# EAGLE design uart_opto_isolation (EAGLE 6.2)
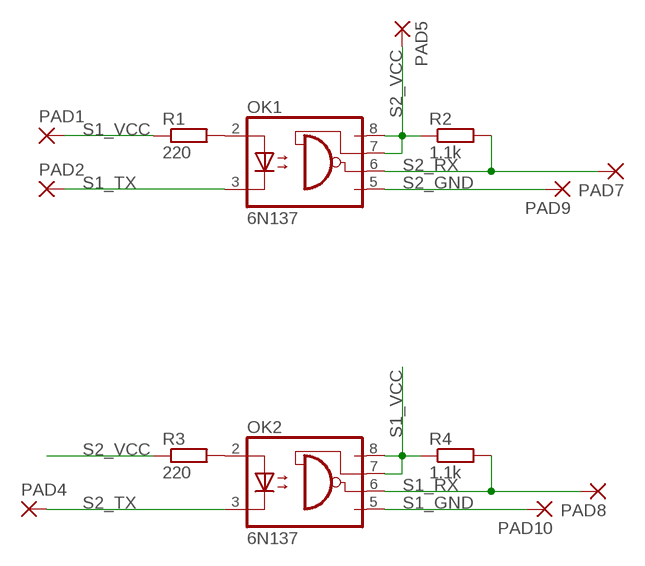
[diagram p0: schematic, sheet 1]

## Parts
OK1  6N137  [DIL08]
OK2  6N137  [DIL08]
PAD1  1,6/0,9  [1,6/0,9]
PAD2  1,6/0,9  [1,6/0,9]
PAD4  1,6/0,9  [1,6/0,9]
PAD5  1,6/0,9  [1,6/0,9]
PAD7  1,6/0,9  [1,6/0,9]
PAD8  1,6/0,9  [1,6/0,9]
PAD9  1,6/0,9  [1,6/0,9]
PAD10  1,6/0,9  [1,6/0,9]
R1  220  R-EU_R0805  [R0805]
R2  1.1k  R-EU_R0805  [R0805]
R3  220  R-EU_R0805  [R0805]
R4  1.1k  R-EU_R0805  [R0805]

## Nets
N$1: OK1.2(A) R1.2
N$2: OK2.2(A) R3.2
S1_GND: OK2.5(GND) PAD10.1(P)
S1_RX: OK2.6(VO) PAD8.1(P) R4.2
S1_TX: OK1.3(C) PAD2.1(P)
S1_VCC: OK2.7(VE) OK2.8(VCC) PAD1.1(P) R1.1 R4.1
S2_GND: OK1.5(GND) PAD9.1(P)
S2_RX: OK1.6(VO) PAD7.1(P) R2.2
S2_TX: OK2.3(C) PAD4.1(P)
S2_VCC: OK1.7(VE) OK1.8(VCC) PAD5.1(P) R2.1 R3.1

## Library data of the parts
OK1 OK2 = optocoupler:6N137: MOTOROLA OPTO COUPLER; MPN: 6N137; OC_FARNELL: 1328376; OC_NEWARK: 52M1895
PAD1 PAD2 PAD4 PAD5 PAD7-PAD10 = wirepad:1,6/0,9: THROUGH-HOLE PAD
R1-R4 = rcl:R-EU_: RESISTOR, European symbol

## Board
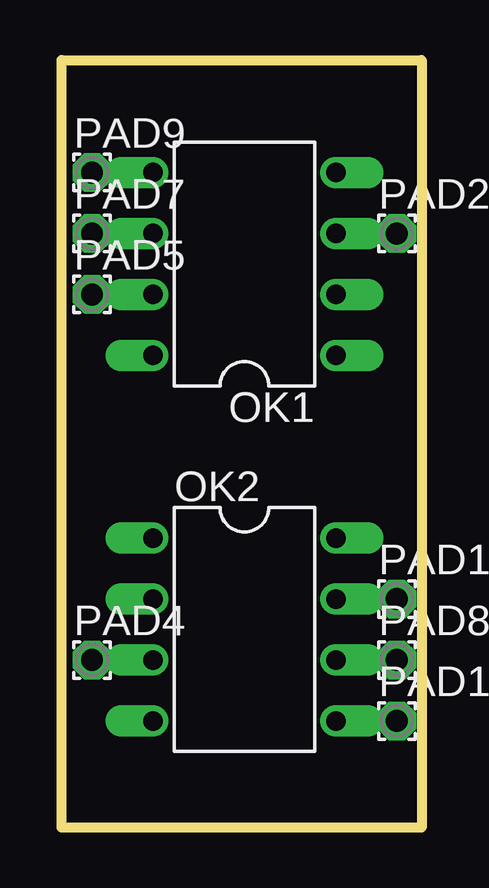
[diagram p1: board, top side]
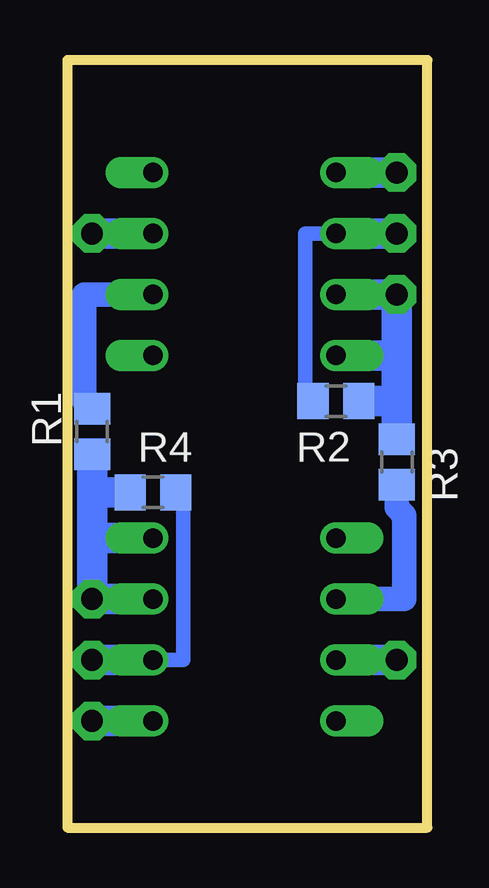
[diagram p2: board, bottom side, seen from below]

Size 15 x 32 mm. Coordinates in mm from the lower left corner, seen from the top.
Outline: 0,32 15,32 15,0 0,0 0,32
Copper layers (1*16): Top 0.035mm / dielectric 1.5mm / Bottom 0.035mm
Design rules: minimum track width 10mil, minimum drill 24mil, track to track 8mil, track to pad 8mil, pad to pad 8mil, via to via 8mil, smd to smd 8mil, copper to edge 40mil, drill to drill 8mil, minimum pad ring 10mil, minimum via ring 8mil, stop-mask expansion 4mil, vias tented up to drill 0mil, thermal gap 10mil

### Footprints (pad centres in the part's own frame; a part is rotated, then mirrored left to right if it is on the bottom)
DIL08 = drill 0.813 offset: 1 -3.81,-3.81; 2 -1.27,-3.81; 3 1.27,-3.81; 4 3.81,-3.81; 5 3.81,3.81; 6 1.27,3.81; 7 -1.27,3.81; 8 -3.81,3.81
1,6/0,9 = drill 0.914 pad 1.6 octagon: 1 0,0
R0805 = smd 1.3 x 1.5: 1 -0.95,0; 2 0.95,0

### Placement (x,y rotation side)
OK1  7.62,23.5 90 top
OK2  7.62,8.26 270 top
PAD1  13.97,9.53 0 top
PAD2  13.97,24.77 0 top
PAD4  1.27,6.99 0 top
PAD5  1.27,22.23 0 top
PAD7  1.27,24.77 0 top
PAD8  13.97,6.99 0 top
PAD9  1.27,27.3 0 top
PAD10  13.97,4.45 0 top
R1  13.97,16.51 90 bottom
R2  3.81,17.78 180 bottom
R3  1.27,15.24 270 bottom
R4  11.43,13.97 0 bottom

### Tracks (layer width: path | path; a pad name or v marks a point on that pad's centre or on a via)
N$1
  Bottom 1.016: OK1.2 14.29,22.23 14.29,17.78 R1.2
N$2
  Bottom 1.016: OK2.2 0.95,9.53 0.95,13.02 1.27,13.34 R3.2
S1_GND
  Bottom 1.27: OK2.5 PAD10.1
S1_RX
  Bottom 0.61: OK2.6 10.16,6.99 10.16,13.34 R4.2
  Bottom 1.27: OK2.6 PAD8.1
S1_TX
  Bottom 1.27: OK1.3 PAD2.1
S1_VCC
  Bottom 1.27: OK2.8 13.97,12.06 | 13.97,12.06 13.97,13.97 | 13.97,13.97 R4.1 | R1.1 13.97,13.97 | OK2.7 PAD1.1 13.97,12.06
S2_GND
  Bottom 1.27: OK1.5 PAD9.1
S2_RX
  Bottom 0.61: R2.2 5.08,18.41 5.08,24.77 OK1.6
  Bottom 1.27: OK1.6 PAD7.1
S2_TX
  Bottom 1.27: OK2.3 PAD4.1
S2_VCC
  Bottom 1.27: R3.1 1.27,17.78 | 1.27,17.78 1.27,19.68 | 1.27,19.68 OK1.8 | R2.1 1.27,17.78 | 1.27,19.68 PAD5.1 OK1.7